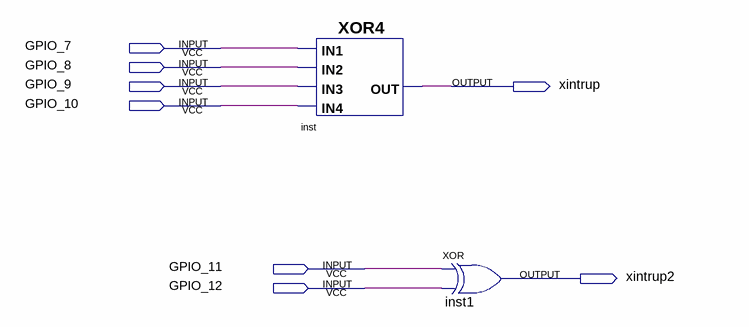
[diagram p0: schematic sheet]
// Quartus schematic gutiarEffects.bdf as structural Verilog: 2 symbols, 8 pins
module gutiarEffects (
  input  GPIO_7,
  input  GPIO_8,
  input  GPIO_9,
  input  GPIO_10,
  input  GPIO_11,
  input  GPIO_12,
  output xintrup,
  output xintrup2
);

  XOR4 inst (.IN3(GPIO_9), .IN4(GPIO_10), .IN2(GPIO_8), .IN1(GPIO_7), .OUT(xintrup));
  xor inst1 (xintrup2, GPIO_11, GPIO_12);
endmodule
